# EAGLE design power-con (EAGLE 9.4.2)
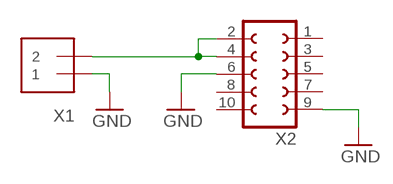
[diagram p0: schematic, sheet 1]

## Parts
X1  WR_TBL_1X2-3.5MM  [WR-TBL-1X2-3.5MM]
X2  FE05-2  [FE05-2]

## Nets
GND: X1.1 X2.6 X2.9
PWR: X1.2 X2.2 X2.4
Unconnected: X2.1 X2.3 X2.5 X2.7 X2.8 X2.10

## Library data of the parts
X1 = sanisimov:WR_TBL_1X2-3.5MM: 3.5mm Terminal block http://www.ladyada.net/library/pcb/eaglelibrary.html
X2 = sanisimov:FE05-2: FEMALE HEADER; OC_FARNELL: unknown; OC_NEWARK: unknown

## Board
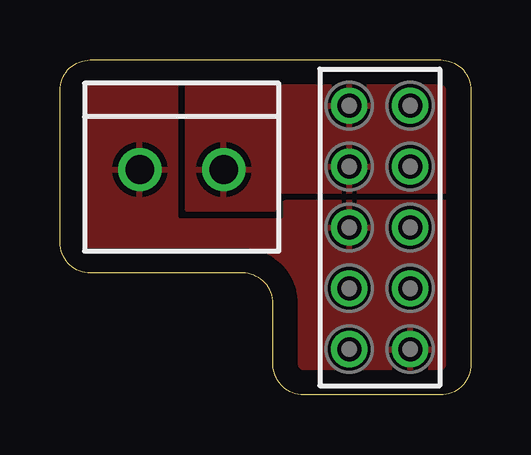
[diagram p1: board, top side]
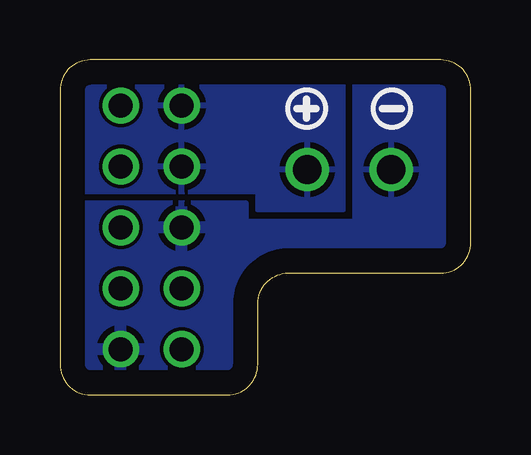
[diagram p2: board, bottom side, seen from below]

Size 17.14 x 13.97 mm. Coordinates in mm from the lower left corner, seen from the top.
Outline: 17.14,12.7 17.14,1.27 arc-90 15.88,0 10.16,0 arc-90 8.89,1.27 8.89,3.81 arc90 7.62,5.08 1.27,5.08 arc-90 0,6.35 0,12.7 arc-90 1.27,13.97 15.88,13.97 arc-90 17.14,12.7
Copper layers (1*16): Top 0.035mm / dielectric 1.5mm / Bottom 0.035mm
Design rules "default": minimum track width 6mil, minimum drill 0.35mm, track to track 6mil, track to pad 6mil, pad to pad 6mil, via to via 6mil, smd to smd 6mil, copper to edge 40mil, drill to drill 6mil, minimum pad ring 10mil, minimum via ring 8mil, stop-mask expansion 4mil, vias tented up to drill 0mil, thermal gap 10mil

### Footprints (pad centres in the part's own frame; a part is rotated, then mirrored left to right if it is on the bottom)
WR-TBL-1X2-3.5MM = drill 1.2: 1 1.75,0; 2 -1.75,0
FE05-2 = drill 1: 1 -5.08,1.27; 2 -5.08,-1.27; 3 -2.54,1.27; 4 -2.54,-1.27; 5 0,1.27; 6 0,-1.27; 7 2.54,1.27; 8 2.54,-1.27; 9 5.08,1.27; 10 5.08,-1.27

### Placement (x,y rotation side)
U$5  [SYMBOL_PLUS]  6.86,11.94 90 bottom
U$6  [SYMBOL_MINUS]  3.3,11.94 180 bottom
X1  5.08,9.4 180 top
X2  13.34,6.99 270 top

### Tracks (layer width: path | path; a pad name or v marks a point on that pad's centre or on a via)
GND
  pour Bottom (isolate 0.254): -0.64,6.35 -0.64,-0.64 17.78,-0.64 17.78,7.62 9.53,7.62 9.53,6.35
  pour Top: 4.83,14.61 -0.64,14.61 -0.64,-0.64 17.78,-0.64 17.78,8 9.4,8 9.4,7.37 arc-90 9.27,7.24 4.95,7.24 arc-90 4.83,7.37
  pour Bottom: -0.64,14.61 -0.64,-0.64 17.78,-0.64 17.78,8 9.4,8 9.4,7.24 4.83,7.24 4.83,14.61
PWR
  pour Top: 5.33,14.61 17.78,14.61 17.78,8.51 8.89,8.51 8.89,7.75 5.33,7.75
  pour Bottom: 5.33,14.61 17.78,14.61 17.78,8.51 8.89,8.51 8.89,7.75 5.33,7.75